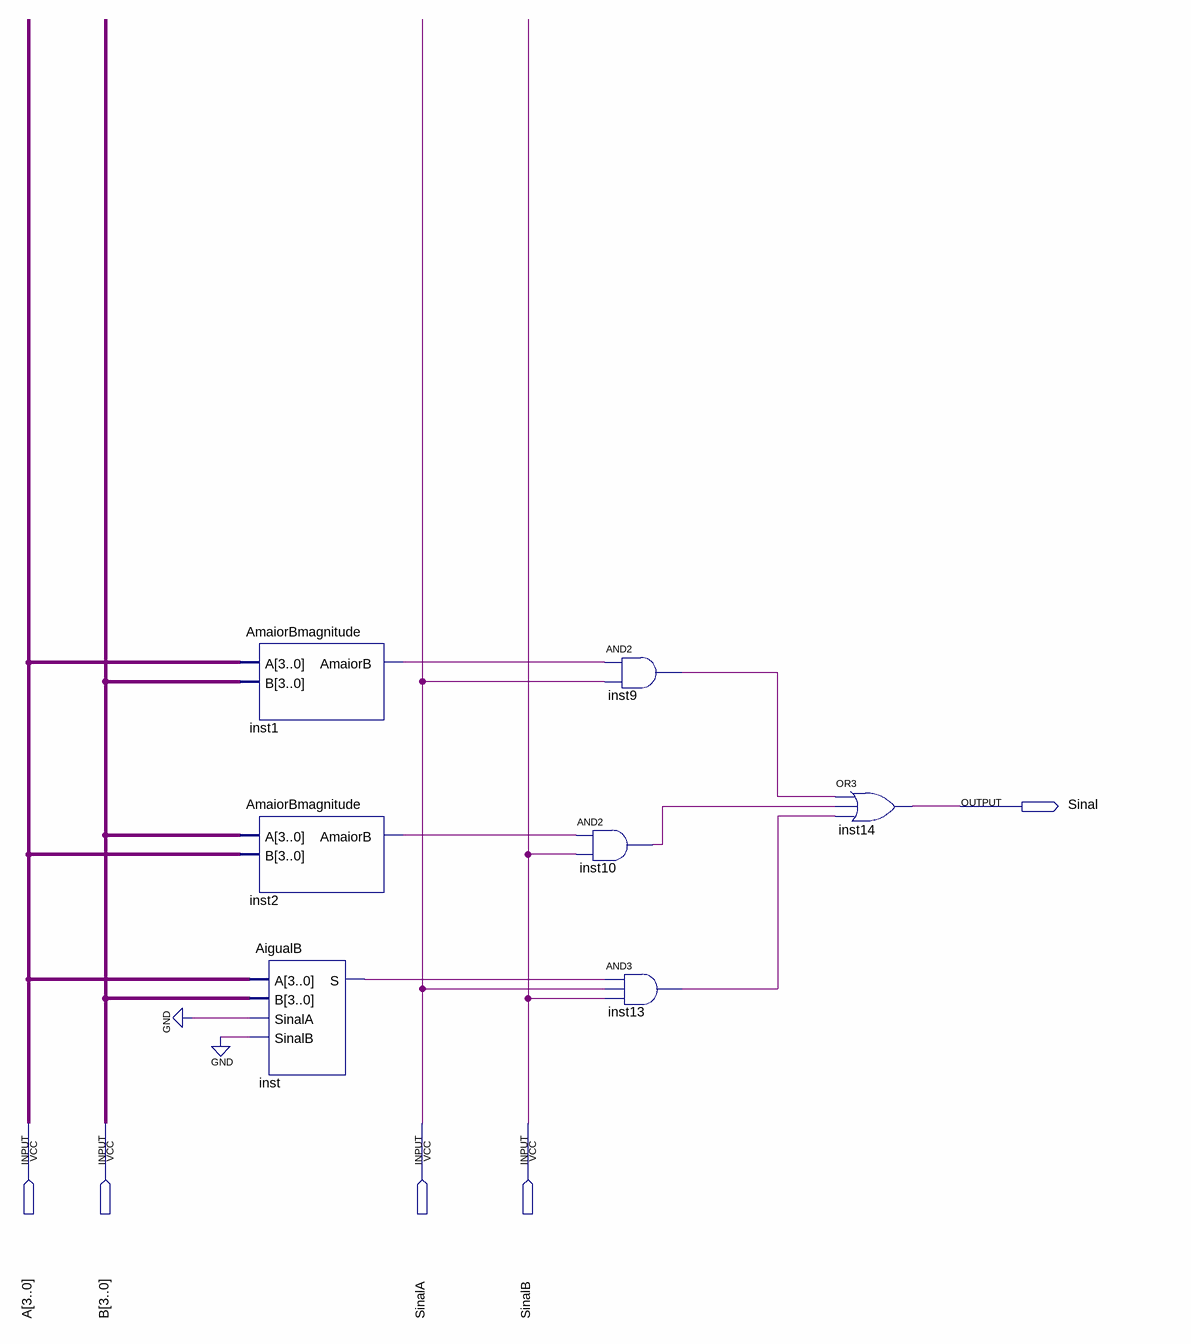
[diagram p0: schematic sheet]
// Quartus schematic decidirSinal.bdf as structural Verilog: 7 symbols, 5 pins
module decidirSinal (
  input  [3:0] A,
  input  [3:0] B,
  input  SinalA,
  input  SinalB,
  output Sinal
);

  wire inst1_amaiorb, inst2_amaiorb, inst9_out, inst10_out, inst13_out, inst_s;

  AmaiorBmagnitude inst1 (.A(A), .B(B), .AmaiorB(inst1_amaiorb));
  AmaiorBmagnitude inst2 (.A(B), .B(A), .AmaiorB(inst2_amaiorb));
  AigualB inst (.A(A), .B(B), .SinalA(1'b0), .SinalB(1'b0), .S(inst_s));
  and inst9 (inst9_out, inst1_amaiorb, SinalA);
  and inst10 (inst10_out, inst2_amaiorb, SinalB);
  and inst13 (inst13_out, inst_s, SinalA, SinalB);
  or inst14 (Sinal, inst9_out, inst10_out, inst13_out);
endmodule
